# Altium schematic sheet DIB_8bit.SchDoc
size A
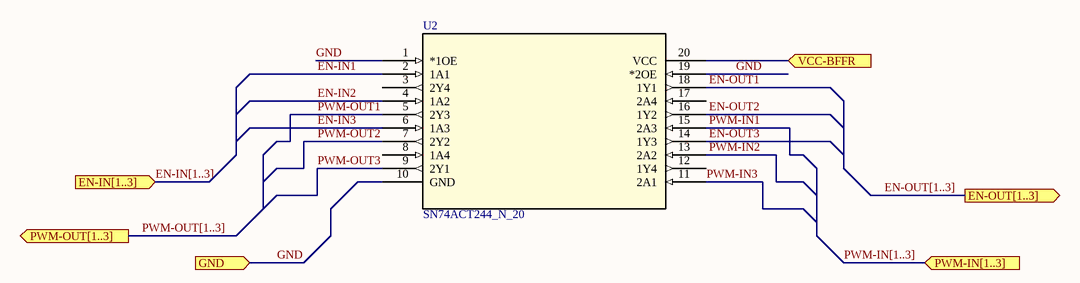
[diagram p0: DIB_8bit.SchDoc]

## Parts
U2  SN74ACT244_N_20  [DW20-M]

## Ports
EN-IN[1..3] (in), EN-OUT[1..3] (out), GND (in), PWM-IN[1..3] (in), PWM-OUT[1..3] (out), VCC-BFFR (in)

## Nets
EN-IN1: U2.2(1A1)
EN-IN2: U2.4(1A2)
EN-IN3: U2.6(1A3)
EN-OUT1: U2.18(1Y1)
EN-OUT2: U2.16(1Y2)
EN-OUT3: U2.14(1Y3)
GND: U2.1(*1OE) U2.10(GND) U2.19(*2OE) ; port GND
PWM-IN1: U2.15(2A3)
PWM-IN2: U2.13(2A2)
PWM-IN3: U2.11(2A1)
PWM-OUT1: U2.5(2Y3)
PWM-OUT2: U2.7(2Y2)
PWM-OUT3: U2.9(2Y1)
VCC-BFFR: U2.20(VCC) ; port VCC-BFFR

Not connected (* = marked no-connect by the designer): U2 3(2Y4) 8(1A4) 12(1Y4) 17(2A4)

## Buses and harness runs
bus EN-IN[1..3] = port EN-IN[1..3]
bus EN-OUT[1..3] = port EN-OUT[1..3]
bus PWM-IN[1..3] = port PWM-IN[1..3]
bus PWM-OUT[1..3] = port PWM-OUT[1..3]

## Library data of the parts
U2 = SN74ACT244_N_20: Imported; Manufacturer: Texas Instruments; INDUSTRY_STD_PKG_TYPE: PDIP; FAMILY_NAME: NON-INVERTING BUFFER/DRIVER; PIN_COUNT: 20; PACKAGE_DESIGNATOR: N; Datasheet URL: http://www.ti.com/lit/gpn/SN74ACT244; GENERIC_PART_NUMBER: SN74ACT244; Vendor: Texas Instruments; Manufacturer_Part_Number: sn74act244_n_20; RefDes: RefDes; Type: DEV; Value: Value